# EAGLE design Debug_adapter (EAGLE 6.1)
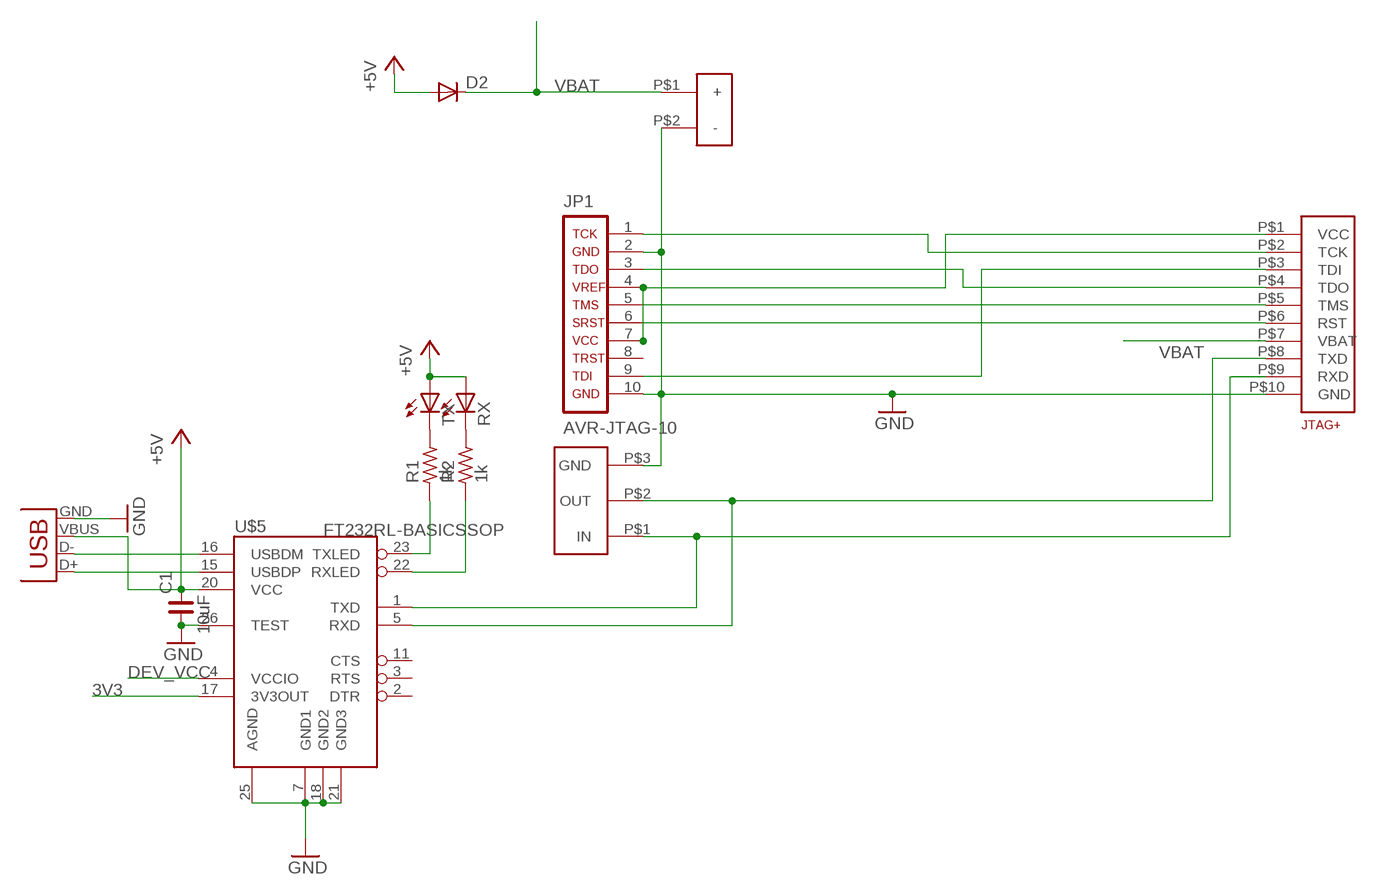
[diagram p0: schematic, sheet 1]

## Parts
C1  10uF  C_0805  [C0805]
D2  DIODESOD  [SOD-323]
JP1  AVR-JTAG-10  [AVR-JTAG-10]
R1  1k  R_0805  [R0805]
R2  1k  R_0805  [R0805]
RX  LEDCHIPLED_0805  [CHIPLED_0805]
TX  LEDCHIPLED_0805  [CHIPLED_0805]
U$1  AVR32_JTAG+SERIAL  [MOLEX_CONNECTOR_10PINS]
U$2  POWER  [POWER]
U$3  SERIAL  [SERVO]
U$5  FT232RL-BASICSSOP  [SSOP28DB]
X1  USBSMD  [USB-MINIB]

## Nets
3V3: U$5.17(3V3OUT)
+5V: C1.2 D2.2(A) RX.A TX.A U$5.20(VCC) X1.VBUS
DEV_VCC: U$5.4(VCCIO)
GND: C1.1 JP1.2 JP1.10 U$1.P$10(GND) U$2.P$2(-) U$3.P$3(GND) U$5.7(GND1) U$5.18(GND2) U$5.21(GND3) U$5.25(AGND) U$5.26(TEST) X1.GND
N$1: JP1.1 U$1.P$2(TCK)
N$2: JP1.9 U$1.P$3(TDI)
N$3: JP1.3 U$1.P$4(TDO)
N$4: JP1.5 U$1.P$5(TMS)
N$5: JP1.6 U$1.P$6(RST)
N$7: JP1.4 JP1.7 U$1.P$1(VCC)
N$11: U$5.16(USBDM) X1.D-
N$12: U$5.15(USBDP) X1.D+
N$13: U$1.P$9(RXD) U$3.P$1(IN) U$5.1(TXD)
N$14: U$1.P$8(TXD) U$3.P$2(OUT) U$5.5(RXD)
N$15: R1.2 TX.C
N$16: R2.2 RX.C
N$17: R1.1 U$5.23(TXLED)
N$18: R2.1 U$5.22(RXLED)
VBAT: D2.1(C) U$1.P$7(VBAT) U$2.P$1(+)
Unconnected: JP1.8 U$5.2(DTR) U$5.3(RTS) U$5.11(CTS)

## Library data of the parts
C1 = rc-master-smd:C_: NON-POLARIZED CAP
D2 = SparkFun:DIODE: Diode These are standard reverse protection diodes and small signal diodes. SMA package can handle up to about 1A. SOD-323 can handle about 200mA. What the SOD-323 package when ordering, there are some mfgs out there that are 5-pin packages.
JP1 = con-special_purpose:AVR-JTAG-10: AVR JTAG Debug/Programming Header
R1 R2 = rc-master-smd:R_: RESISTOR
RX TX = led:LED: LED OSRAM: - CHIPLED LG R971, LG N971, LY N971, LG Q971, LY Q971, LO R971, LY R971 LH N974, LH R974 LS Q976, LO Q976, LY Q976 LO Q996 - Hyper CHIPLED LW Q18S LB Q993, LB Q99A, LB R99A - SideLED LS A670, LO A670, LY A670, LG A670, LP A670 LB A673, LV A673, LT A673, LW A673 LH A674 LY A675 LS A676, LA A676, LO A676, LY A676, LW A676 LS A679, LY A679, LG A679 - Hyper Micro SIDELED® LS Y876, LA Y876, LO Y876, LY Y876 LT Y87S - SmartLED LW L88C, LW L88S LB L89C, LB L89S, LG L890 LS L89K, LO L89K, LY L89K LS L896, LA L896, LO L896, LY L896 - TOPLED LS T670, LO T670, LY T670, LG T670, LP T670 LSG T670, LSP T670, LSY T670, LOP T670, LYG T670 LG T671, LOG T671, LSG T671 LB T673, LV T673, LT T673, LW T673 LH T674 LS T676, LA T676, LO T676, LY T676, LB T676, LH T676, LSB T676, LW T676 LB T67C, LV T67C, LT T67C, LS T67K, LO T67K, LY T67K, LW E67C LS E67B, LA E67B, LO E67B, LY E67B, LB E67C, LV E67C, LT E67C LW T67C LS T679, LY T679, LG T679 LS T770, LO T770, LY T770, LG T770, LP T770 LB T773, LV T773, LT T773, LW T773 LH T774 LS E675, LA E675, LY E675, LS T675 LS T776, LA T776, LO T776, LY T776, LB T776 LHGB T686 LT T68C, LB T68C - Hyper Mini TOPLED® LB M676 - Mini TOPLED Santana® LG M470 LS M47K, LO M47K, LY M47K Source: http://www.osram.convergy.de LUXEON: - LUMILED® LXK2-PW12-R00, LXK2-PW12-S00, LXK2-PW14-U00, LXK2-PW14-V00 LXK2-PM12-R00, LXK2-PM12-S00, LXK2-PM14-U00 LXK2-PE12-Q00, LXK2-PE12-R00, LXK2-PE12-S00, LXK2-PE14-T00, LXK2-PE14-U00 LXK2-PB12-K00, LXK2-PB12-L00, LXK2-PB12-M00, LXK2-PB14-N00, LXK2-PB14-P00, LXK2-PB14-Q00 LXK2-PR12-L00, LXK2-PR12-M00, LXK2-PR14-Q00, LXK2-PR14-R00 LXK2-PD12-Q00, LXK2-PD12-R00, LXK2-PD12-S00 LXK2-PH12-R00, LXK2-PH12-S00 LXK2-PL12-P00, LXK2-PL12-Q00, LXK2-PL12-R00 Source: www.luxeon.com KINGBRIGHT: KA-3528ASYC Source: www.kingbright.com
U$1 = con-special_purpose:AVR32_JTAG+SERIAL: Unified compact debug port with JTAG, 7-12V power supply (VBAT) and serial port.
U$2 = con-special_purpose:POWER
U$3 = con-special_purpose:SERIAL
U$5 = SpecialIC:FT232RL-BASIC: USB UART This is the simplified version of the FT232RL unit. Only what you need, nothing you don't. Spark Fun Electronics SKU : COM-00650
X1 = SpecialIC:USB: USB Connectors USB-B-PTH is fully proven SKU : PRT-00139 USB-miniB is fully proven SKU : PRT-00587 USB-A-PCB is untested. USB-A-H is throughly reviewed, but untested. Spark Fun Electronics SKU : PRT-00437 USB-B-SMT is throughly reviewed, but untested. Needs silkscreen touching up. USB-A-S has not been used/tested USB-MB-H has not been used/tested

## Board
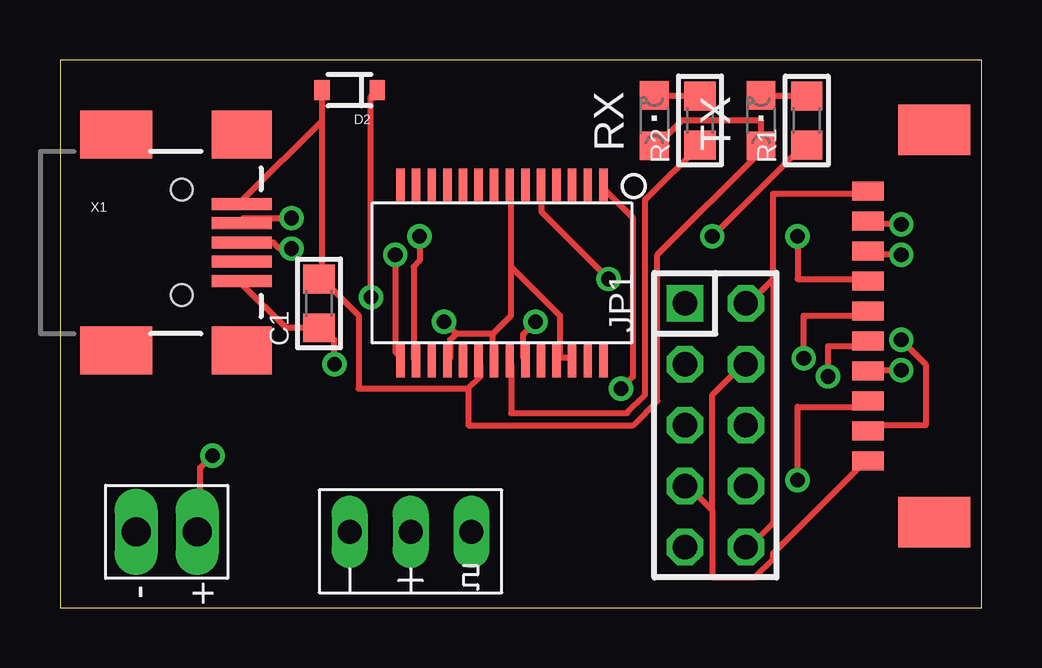
[diagram p1: board, top side]
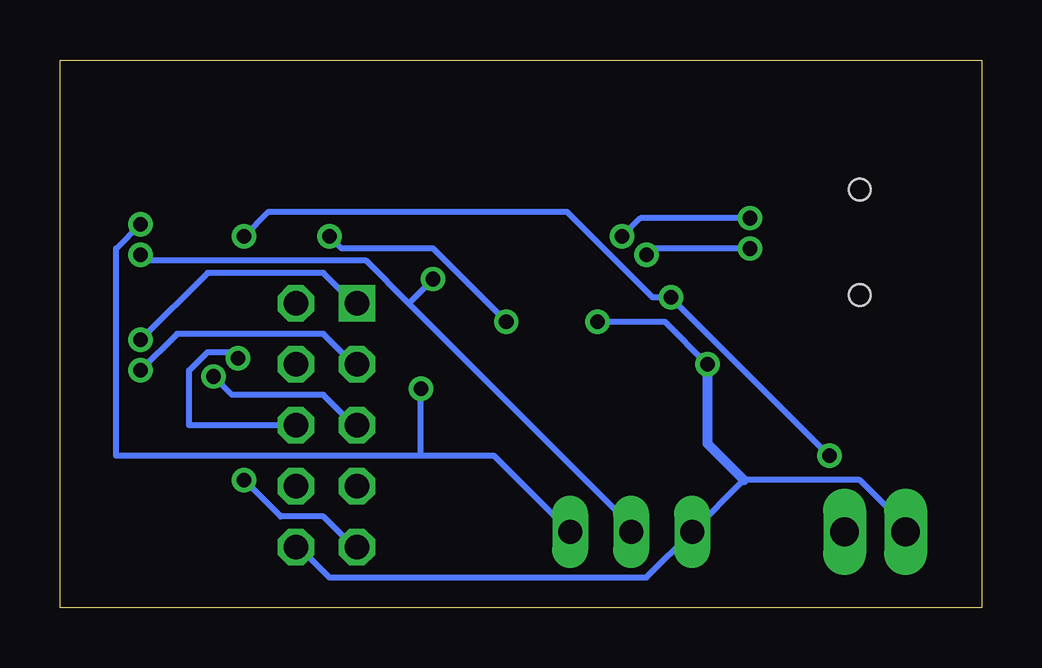
[diagram p2: board, bottom side, seen from below]

Size 38.41 x 22.85 mm. Coordinates in mm from the lower left corner, seen from the top.
Outline: 0,0 38.41,0 38.41,22.85 0,22.85 0,0
Copper layers (1*16): Top 0.035mm / dielectric 1.5mm / Bottom 0.035mm
Design rules: minimum track width 10mil, minimum drill 24mil, track to track 8mil, track to pad 8mil, pad to pad 8mil, via to via 8mil, smd to smd 8mil, copper to edge 40mil, drill to drill 8mil, minimum pad ring 10mil, minimum via ring 8mil, stop-mask expansion 4mil, vias tented up to drill 0mil, thermal gap 10mil

### Footprints (pad centres in the part's own frame; a part is rotated, then mirrored left to right if it is on the bottom)
C0805 = smd 1.2 x 1.3: 1 -1.016,0; 2 1.016,0
SOD-323 = smd 0.63 x 0.83: 1 -1.15,0; 2 1.15,0
AVR-JTAG-10 = drill 1.016 square: 1 -5.08,-1.27 | drill 1.016 octagon: 2 -5.08,1.27; 3 -2.54,-1.27; 4 -2.54,1.27; 5 0,-1.27; 6 0,1.27; 7 2.54,-1.27; 8 2.54,1.27; 9 5.08,-1.27; 10 5.08,1.27
R0805 = smd 1.2 x 1.3: 1 -1.016,0; 2 1.016,0
CHIPLED_0805 = smd 1.2 x 1.2: A 0,-1.05; C 0,1.05
MOLEX_CONNECTOR_10PINS = smd 0.8 x 1.3: P$1 -11.65,-0.65; P$2 -10.4,-0.65; P$3 -9.15,-0.65; P$4 -7.9,-0.65; P$5 -6.65,-0.65; P$6 -5.4,-0.65; P$7 -4.15,-0.65; P$8 -2.9,-0.65; P$9 -1.65,-0.65; P$10 -0.4,-0.65 | smd 2.1 x 3: P$11 -14.2,-3.4; P$12 2.15,-3.4
POWER = drill 1.2 long: P$1 0,2.54; P$2 0,0
SERVO = drill 1 long: P$1 0,2.54; P$2 0,0; P$3 0,-2.54
SSOP28DB = smd 0.348 x 1.397: 1 -4.225,-3.656; 2 -3.575,-3.656; 3 -2.925,-3.656; 4 -2.275,-3.656; 5 -1.625,-3.656; 6 -0.975,-3.656; 7 -0.325,-3.656; 8 0.325,-3.656; 9 0.975,-3.656; 10 1.625,-3.656; 11 2.275,-3.656; 12 2.925,-3.656; 13 3.575,-3.656; 14 4.225,-3.656; 15 4.225,3.656; 16 3.575,3.656; 17 2.925,3.656; 18 2.275,3.656; 19 1.625,3.656; 20 0.975,3.656; 21 0.325,3.656; 22 -0.325,3.656; 23 -0.975,3.656; 24 -1.625,3.656; 25 -2.275,3.656; 26 -2.925,3.656; 27 -3.575,3.656; 28 -4.225,3.656
USB-MINIB = smd 2.5 x 0.5: D+ 2.5,0; D- 2.5,0.8; GND 2.5,-1.6; ID 2.5,-0.8; VBUS 2.5,1.6 | smd 3 x 2: GND@1 -2.746,-4.5; GND@2 -2.746,4.5 | smd 2.5 x 2: GND@3 2.5,4.5; GND@4 2.5,-4.5 | hole 0.9: 0,2.2; 0,-2.2

### Placement (x,y rotation side)
C1  10.79,12.7 90 top
D2  12.06,21.59 180 top
JP1  27.3,7.62 270 top
R1  31.11,20.32 90 top
R2  26.67,20.32 90 top
RX  24.77,20.32 0 top
TX  29.21,20.32 0 top
U$1  33.02,17.78 90 top
U$2  3.17,3.17 270 top
U$3  14.61,3.17 270 top
U$5  18.41,13.97 180 top
X1  5.08,15.24 0 top

### Tracks (layer width: path | path; a pad name or v marks a point on that pad's centre or on a via)
+5V
  Top 0.254: RX.A 24.89,19.3 25.91,20.32 29.21,20.32 TX.A 29.21,19.05 24.89,14.73 24.89,8.64 23.88,7.62 17.02,7.62 17.02,9.14 | 10.92,13.72 10.92,20.32 | 10.92,20.32 10.92,21.59 D2.2 | 17.02,9.14 17.53,9.65 17.53,10.16 U$5.20 | 17.02,9.14 12.45,9.14 12.45,12.19 10.92,13.72 | 10.92,13.72 C1.2 | 10.92,20.32 7.62,17.02 X1.VBUS
GND  (via drill 0.61)
  Top 0.254: X1.GND 7.62,13.46 9.4,11.68 C1.1 10.92,11.68 11.43,11.18 v11.43,10.16 | 20.83,10.41 21.34,10.41 U$5.26 | 16.51,11.43 16.26,11.18 16.26,10.41 U$5.18 | 18.03,11.43 16.51,11.43 | 18.03,11.43 18.03,10.41 U$5.21 | 18.8,14.22 18.8,12.19 18.03,11.43 | 18.8,14.22 18.8,17.53 U$5.7 | 20.83,10.41 20.83,12.19 18.8,14.22 | 20.83,10.41 U$5.25 | 16.51,11.43 v16,11.94 | 29.72,13.72 29.72,17.27 33.53,17.27 U$1.P$10 | 29.72,13.72 28.7,12.7 JP1.2 | 29.72,13.72 29.72,3.56 28.7,2.54 JP1.10
  Bottom 0.254: v11.43,10.16 13.21,11.94 v16,11.94 | U$2.P$2 3.05,3.3 5.08,5.33 9.91,5.33 U$3.P$3 13.97,1.27 27.18,1.27 28.45,2.54 JP1.10
  Bottom 0.406: v11.43,10.16 11.43,6.86 9.91,5.33
N$1  (via drill 0.61)
  Top 0.254: v35.05,11.18 36.07,10.16 36.07,7.62 33.78,7.62 U$1.P$2
  Bottom 0.254: v35.05,11.18 32.26,13.97 27.43,13.97 26.16,12.7 JP1.1
N$2  (via drill 0.61)
  Top 0.254: v30.73,5.33 30.73,8.38 33.53,8.38 U$1.P$3
  Bottom 0.254: v30.73,5.33 29.21,3.81 27.43,3.81 26.16,2.54 JP1.9
N$3  (via drill 0.61)
  Top 0.254: v35.05,9.91 33.78,9.91 U$1.P$4
  Bottom 0.254: v35.05,9.91 33.53,11.43 27.43,11.43 26.16,10.16 JP1.3
N$4  (via drill 0.61)
  Top 0.254: v32,9.65 32,10.92 33.53,10.92 U$1.P$5
  Bottom 0.254: v32,9.65 31.24,8.89 27.43,8.89 26.16,7.62 JP1.5
N$5  (via drill 0.61)
  Top 0.254: v30.99,10.41 30.99,12.19 33.53,12.19 U$1.P$6
  Bottom 0.254: v30.99,10.41 31.24,10.67 32.26,10.67 33.02,9.91 33.02,7.62 JP1.6
N$7
  Top 0.254: 27.18,4.06 27.18,1.27 28.96,1.27 29.72,2.03 29.72,2.29 33.53,6.1 U$1.P$1 | 27.18,4.06 26.16,5.08 JP1.7 | 27.18,4.06 27.18,8.89 28.45,10.16 JP1.4
N$11  (via drill 0.61)
  Top 0.254: v14.99,15.49 14.99,14.48 14.73,14.22 14.73,10.41 U$5.16 | v9.65,16.26 7.62,16.26 X1.D-
  Bottom 0.254: v14.99,15.49 14.22,16.26 v9.65,16.26
N$12  (via drill 0.61)
  Top 0.254: v13.97,14.73 13.97,10.67 14.22,10.41 U$5.15 | v9.65,14.99 9.14,14.99 8.89,15.24 X1.D+
  Bottom 0.254: v13.97,14.73 13.72,14.99 v9.65,14.99
N$13  (via drill 0.61)
  Top 0.254: v35.05,16 33.78,16 U$1.P$9 | v23.37,9.14 23.88,9.65 23.88,16.26 22.61,17.53 U$5.1
  Bottom 0.254: v35.05,16 36.07,14.99 36.07,6.35 23.37,6.35 | 23.37,6.35 20.32,6.35 U$3.P$1 | 23.37,6.35 v23.37,9.14
N$14  (via drill 0.61)
  Top 0.254: v35.05,14.73 33.78,14.73 U$1.P$8 | v22.86,13.72 20.07,16.51 20.07,17.53 U$5.5
  Bottom 0.254: v35.05,14.73 34.8,14.48 25.65,14.48 23.88,12.7 | 23.88,12.7 14.48,3.3 U$3.P$2 | 23.88,12.7 v22.86,13.72
N$15
  Top 0.254: R1.2 29.21,21.34 TX.C
N$16
  Top 0.254: R2.2 24.89,21.34 RX.C
N$17  (via drill 0.61)
  Top 0.254: v27.18,15.49 30.99,19.3 R1.1 | v19.81,11.94 19.3,11.43 19.3,10.41 U$5.23
  Bottom 0.254: v27.18,15.49 26.67,14.99 22.86,14.99 v19.81,11.94
N$18
  Top 0.254: R2.1 24.38,17.02 24.38,8.89 23.62,8.13 18.8,8.13 18.8,10.16 U$5.22
VBAT  (via drill 0.61)
  Top 0.254: v12.95,12.95 12.95,21.34 D2.1 | v6.35,6.35 5.84,5.84 5.84,3.3 U$2.P$1 | v30.73,15.49 30.73,13.72 33.53,13.72 U$1.P$7
  Bottom 0.254: v6.35,6.35 v12.95,12.95 13.72,12.95 17.27,16.51 29.72,16.51 v30.73,15.49